# Altium project IRIS-EXT-04-BRK.PrjPcb
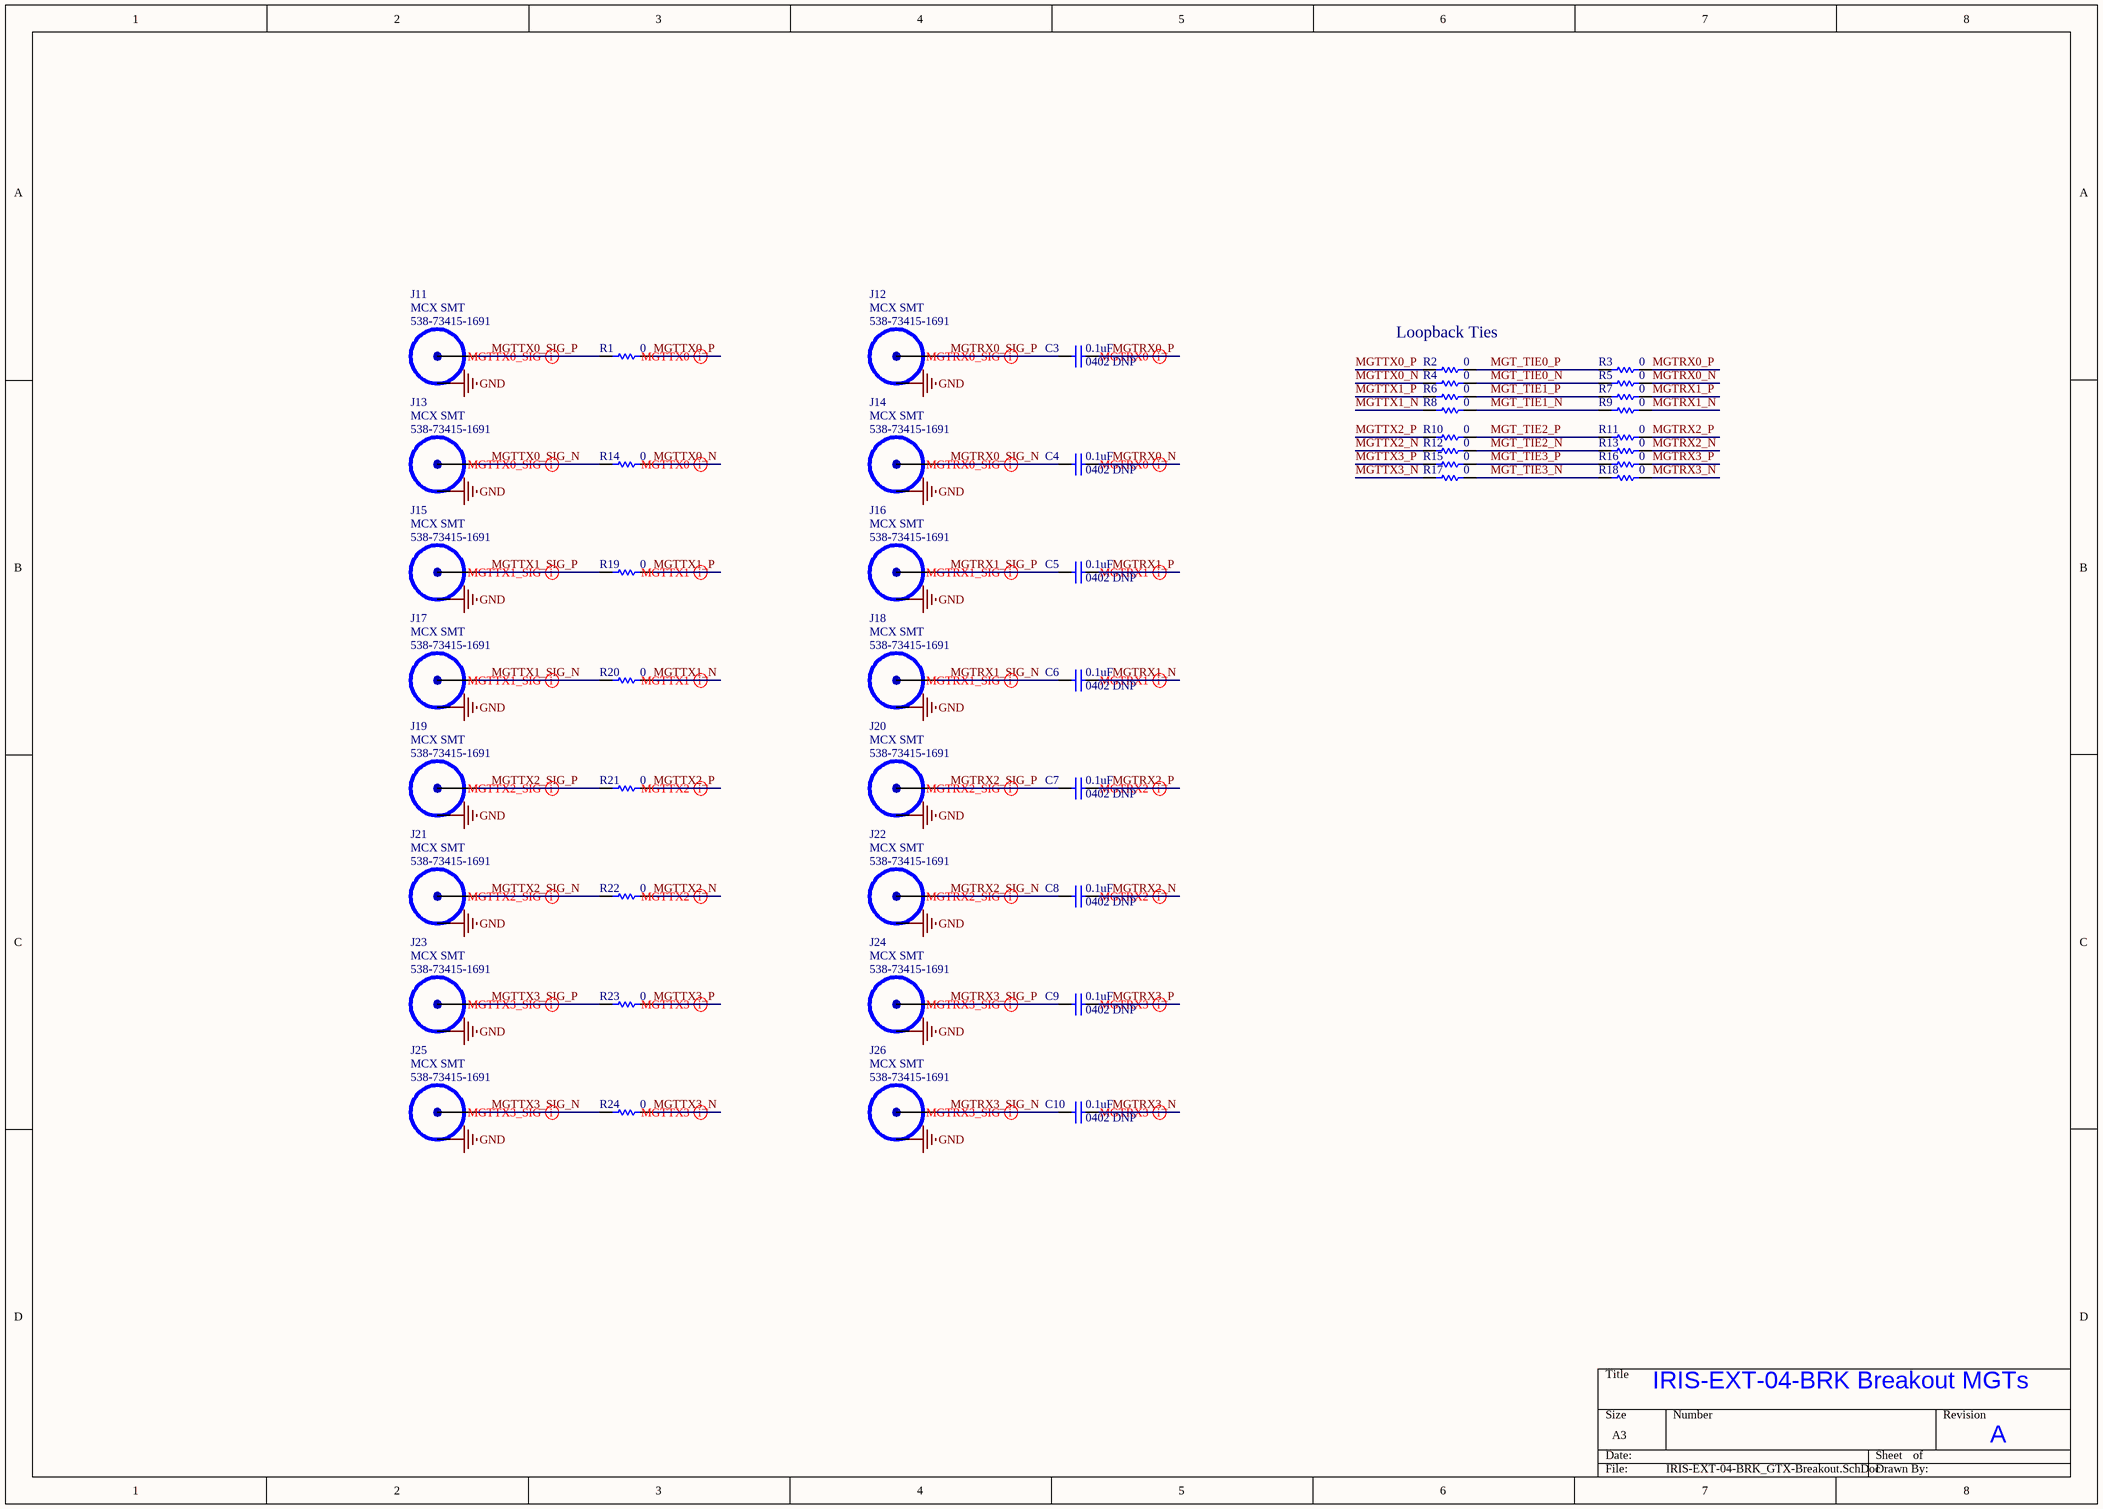
[diagram p0: IRIS-EXT-04-BRK_GTX-Breakout.SchDoc]
2 sheets, 67 parts. Net scope: global (net labels, ports and power ports of the same name join across sheets).
Board file: IRIS-EXT-04-BRK-AA.PcbDoc
Sheets:
  IRIS-EXT-04-BRK_GTX-Breakout.SchDoc
  IRIS-EXT-04-BRK_Top.SchDoc

## Sheet IRIS-EXT-04-BRK_GTX-Breakout.SchDoc
size A3

### Parts
C3  0402 DNP  value 0.1uF  [0402_SMT_CAP]
C4  0402 DNP  value 0.1uF  [0402_SMT_CAP]
C5  0402 DNP  value 0.1uF  [0402_SMT_CAP]
C6  0402 DNP  value 0.1uF  [0402_SMT_CAP]
C7  0402 DNP  value 0.1uF  [0402_SMT_CAP]
C8  0402 DNP  value 0.1uF  [0402_SMT_CAP]
C9  0402 DNP  value 0.1uF  [0402_SMT_CAP]
C10  0402 DNP  value 0.1uF  [0402_SMT_CAP]
J11  MCX SMT  Supplier Part Number 1: 538-73415-1691  [Molex-734151691]
J12  MCX SMT  Supplier Part Number 1: 538-73415-1691  [Molex-734151691]
J13  MCX SMT  Supplier Part Number 1: 538-73415-1691  [Molex-734151691]
J14  MCX SMT  Supplier Part Number 1: 538-73415-1691  [Molex-734151691]
J15  MCX SMT  Supplier Part Number 1: 538-73415-1691  [Molex-734151691]
J16  MCX SMT  Supplier Part Number 1: 538-73415-1691  [Molex-734151691]
J17  MCX SMT  Supplier Part Number 1: 538-73415-1691  [Molex-734151691]
J18  MCX SMT  Supplier Part Number 1: 538-73415-1691  [Molex-734151691]
J19  MCX SMT  Supplier Part Number 1: 538-73415-1691  [Molex-734151691]
J20  MCX SMT  Supplier Part Number 1: 538-73415-1691  [Molex-734151691]
J21  MCX SMT  Supplier Part Number 1: 538-73415-1691  [Molex-734151691]
J22  MCX SMT  Supplier Part Number 1: 538-73415-1691  [Molex-734151691]
J23  MCX SMT  Supplier Part Number 1: 538-73415-1691  [Molex-734151691]
J24  MCX SMT  Supplier Part Number 1: 538-73415-1691  [Molex-734151691]
J25  MCX SMT  Supplier Part Number 1: 538-73415-1691  [Molex-734151691]
J26  MCX SMT  Supplier Part Number 1: 538-73415-1691  [Molex-734151691]
R1  value 0  [0402_SMT_RES]  (hidden comment: 0402 DNP)
R2  value 0  [0603_SMT_RES]  (hidden comment: 0603)
R3  value 0  [0603_SMT_RES]  (hidden comment: 0603)
R4  value 0  [0603_SMT_RES]  (hidden comment: 0603)
R5  value 0  [0603_SMT_RES]  (hidden comment: 0603)
R6  value 0  [0603_SMT_RES]  (hidden comment: 0603)
R7  value 0  [0603_SMT_RES]  (hidden comment: 0603)
R8  value 0  [0603_SMT_RES]  (hidden comment: 0603)
R9  value 0  [0603_SMT_RES]  (hidden comment: 0603)
R10  value 0  [0603_SMT_RES]  (hidden comment: 0603)
R11  value 0  [0603_SMT_RES]  (hidden comment: 0603)
R12  value 0  [0603_SMT_RES]  (hidden comment: 0603)
R13  value 0  [0603_SMT_RES]  (hidden comment: 0603)
R14  value 0  [0402_SMT_RES]  (hidden comment: 0402 DNP)
R15  value 0  [0603_SMT_RES]  (hidden comment: 0603)
R16  value 0  [0603_SMT_RES]  (hidden comment: 0603)
R17  value 0  [0603_SMT_RES]  (hidden comment: 0603)
R18  value 0  [0603_SMT_RES]  (hidden comment: 0603)
R19  value 0  [0402_SMT_RES]  (hidden comment: 0402 DNP)
R20  value 0  [0402_SMT_RES]  (hidden comment: 0402 DNP)
R21  value 0  [0402_SMT_RES]  (hidden comment: 0402 DNP)
R22  value 0  [0402_SMT_RES]  (hidden comment: 0402 DNP)
R23  value 0  [0402_SMT_RES]  (hidden comment: 0402 DNP)
R24  value 0  [0402_SMT_RES]  (hidden comment: 0402 DNP)

### Nets
GND: J11.0(GND) J12.0(GND) J13.0(GND) J14.0(GND) J15.0(GND) J16.0(GND) J17.0(GND) J18.0(GND) J19.0(GND) J20.0(GND) J21.0(GND) J22.0(GND) J23.0(GND) J24.0(GND) J25.0(GND) J26.0(GND)
MGT_TIE0_N: R4.1 R5.2
MGT_TIE0_P: R2.1 R3.2
MGT_TIE1_N: R8.1 R9.2
MGT_TIE1_P: R6.1 R7.2
MGT_TIE2_N: R12.1 R13.2
MGT_TIE2_P: R10.1 R11.2
MGT_TIE3_N: R17.1 R18.2
MGT_TIE3_P: R15.1 R16.2
MGTRX0_N: C4.1 R5.1
MGTRX0_P: C3.1 R3.1
MGTRX0_SIG_N: C4.2 J14.1(SIG)
MGTRX0_SIG_P: C3.2 J12.1(SIG)
MGTRX1_N: C6.1 R9.1
MGTRX1_P: C5.1 R7.1
MGTRX1_SIG_N: C6.2 J18.1(SIG)
MGTRX1_SIG_P: C5.2 J16.1(SIG)
MGTRX2_N: C8.1 R13.1
MGTRX2_P: C7.1 R11.1
MGTRX2_SIG_N: C8.2 J22.1(SIG)
MGTRX2_SIG_P: C7.2 J20.1(SIG)
MGTRX3_N: C10.1 R18.1
MGTRX3_P: C9.1 R16.1
MGTRX3_SIG_N: C10.2 J26.1(SIG)
MGTRX3_SIG_P: C9.2 J24.1(SIG)
MGTTX0_N: R4.2 R14.2
MGTTX0_P: R1.2 R2.2
MGTTX0_SIG_N: J13.1(SIG) R14.1
MGTTX0_SIG_P: J11.1(SIG) R1.1
MGTTX1_N: R8.2 R20.2
MGTTX1_P: R6.2 R19.2
MGTTX1_SIG_N: J17.1(SIG) R20.1
MGTTX1_SIG_P: J15.1(SIG) R19.1
MGTTX2_N: R12.2 R22.2
MGTTX2_P: R10.2 R21.2
MGTTX2_SIG_N: J21.1(SIG) R22.1
MGTTX2_SIG_P: J19.1(SIG) R21.1
MGTTX3_N: R17.2 R24.2
MGTTX3_P: R15.2 R23.2
MGTTX3_SIG_N: J25.1(SIG) R24.1
MGTTX3_SIG_P: J23.1(SIG) R23.1

### Layout directives
differential pair: MGTRX0_N, MGTRX0_P, MGTRX0_SIG_N, MGTRX0_SIG_P, MGTRX1_N, MGTRX1_P, MGTRX1_SIG_N, MGTRX1_SIG_P, MGTRX2_N, MGTRX2_P, MGTRX2_SIG_N, MGTRX2_SIG_P, MGTRX3_N, MGTRX3_P, MGTRX3_SIG_N, MGTRX3_SIG_P, MGTTX0_N, MGTTX0_P, MGTTX0_SIG_N, MGTTX0_SIG_P, MGTTX1_N, MGTTX1_P, MGTTX1_SIG_N, MGTTX1_SIG_P, MGTTX2_N, MGTTX2_P, MGTTX2_SIG_N, MGTTX2_SIG_P, MGTTX3_N, MGTTX3_P, MGTTX3_SIG_N, MGTTX3_SIG_P

### Notes on the sheet
- Loopback Ties
- IRIS-EXT-04-BRK Breakout MGTs
- A

### Library data of the parts
C3-C10 = Cap_0402: 0402 SMT Capacitor; Supplier 1: Mouser; Supplier Part Number 1: 81-GRM155R71C104JA8D
J11-J26 = Molex-734151691: Molex 50 Ohm SMT MCX Jack; Supplier 1: Mouser
R1 R14 R19-R24 = Res_0402: 0402 SMT Resistor; Supplier 1: Mouser; Supplier Part Number 1: 667-ERJ-2GE0R00X
R2-R13 R15-R18 = Res_0603: 0603 SMT Resistor; Supplier 1: Mouser; Supplier Part Number 1: 667-ERJ-3GEY0R00V; Supplier 2: Digi-Key; Supplier Part Number 2: P0.0GCT-ND; ClassName: NoCollide

## Sheet IRIS-EXT-04-BRK_Top.SchDoc
size A3
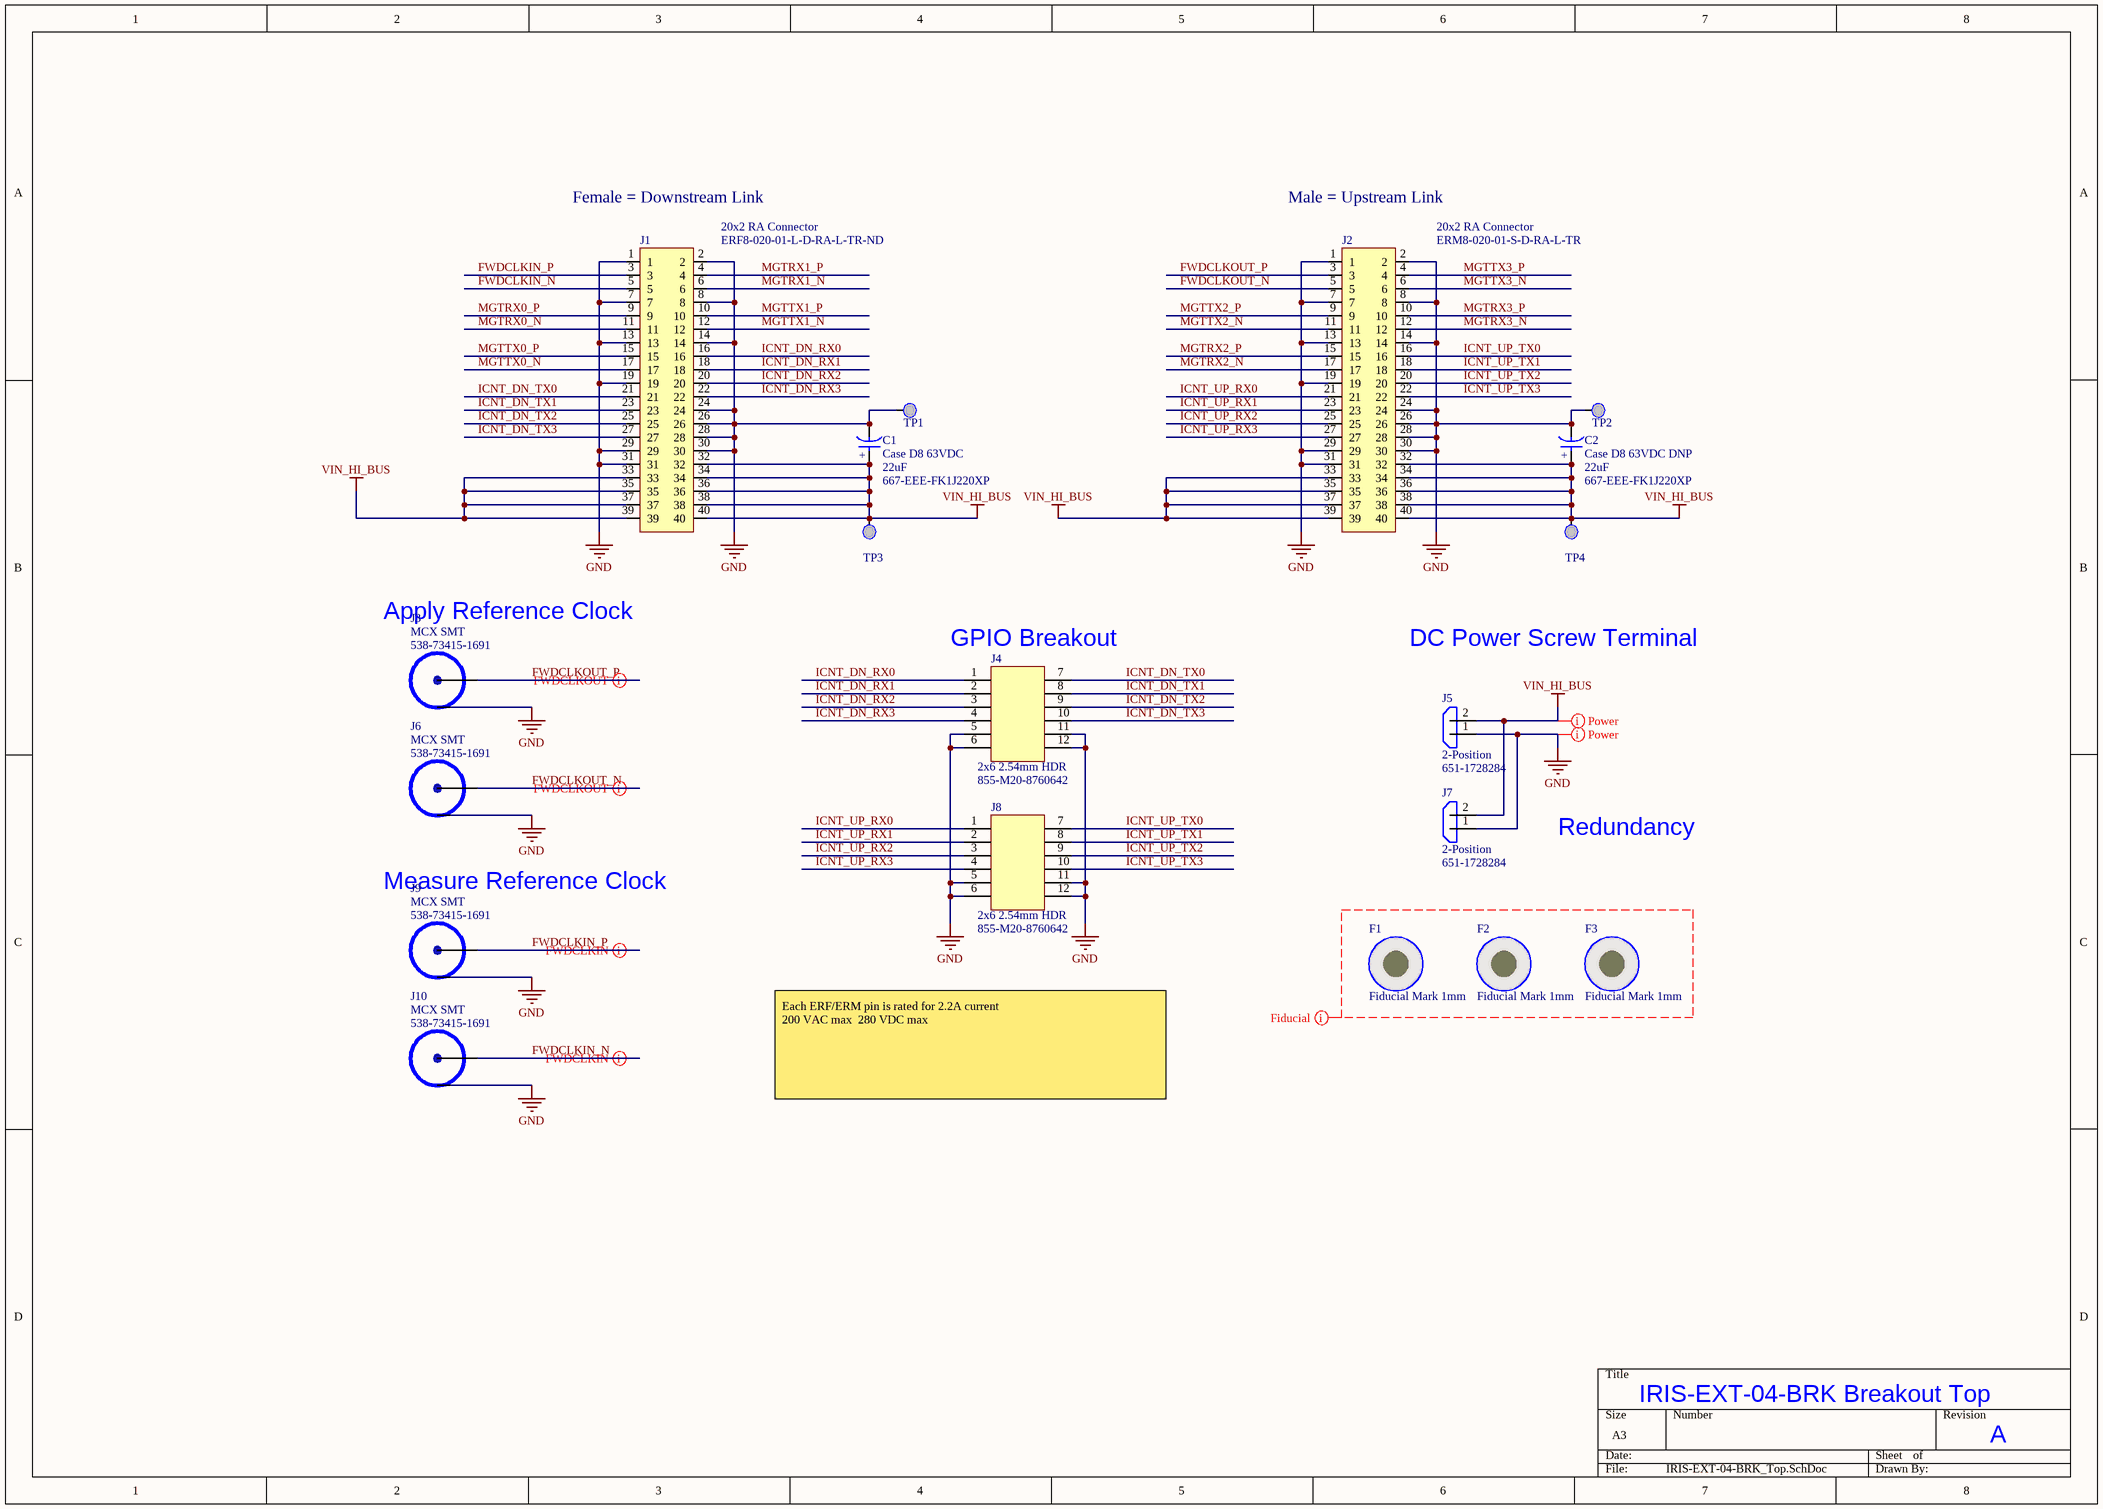
[diagram p1: IRIS-EXT-04-BRK_Top.SchDoc]

### Parts
C1  Case D8 63VDC  value 22uF  Supplier Part Number 1: 667-EEE-FK1J220XP  [Panasonic_SMT_D8]
C2  Case D8 63VDC DNP  value 22uF  Supplier Part Number 1: 667-EEE-FK1J220XP  [Panasonic_SMT_D8]
F1  Fiducial Mark 1mm  [1mm_FIDUCIAL]
F2  Fiducial Mark 1mm  [1mm_FIDUCIAL]
F3  Fiducial Mark 1mm  [1mm_FIDUCIAL]
J1  20x2 RA Connector  Supplier Part Number 1: ERF8-020-01-L-D-RA-L-TR-ND  [ERF8-020-01-L-D-RA-L-TR]
J2  20x2 RA Connector  [ERM8-020-01-S-D-RA-L-TR]
J3  MCX SMT  Supplier Part Number 1: 538-73415-1691  [Molex-734151691]
J4  2x6 2.54mm HDR  Supplier Part Number 1: 855-M20-8760642  [M20-876-350012]
J5  2-Position  Supplier Part Number 1: 651-1728284  [Phoenix-1728284]
J6  MCX SMT  Supplier Part Number 1: 538-73415-1691  [Molex-734151691]
J7  2-Position  Supplier Part Number 1: 651-1728284  [Phoenix-1728284]
J8  2x6 2.54mm HDR  Supplier Part Number 1: 855-M20-8760642  [M20-876-350012]
J9  MCX SMT  Supplier Part Number 1: 538-73415-1691  [Molex-734151691]
J10  MCX SMT  Supplier Part Number 1: 538-73415-1691  [Molex-734151691]
TP1  Testpoint  [Keystone-Red-TP]  (value not drawn)
TP2  Testpoint  [Keystone-Red-TP]  (value not drawn)
TP3  Testpoint  [Keystone-Red-TP]  (value not drawn)
TP4  Testpoint  [Keystone-Red-TP]  (value not drawn)

### Nets
GND: C1.K C2.K J1.1 J1.2 J1.7 J1.8 J1.13 J1.14 J1.19 J1.24 J1.26 J1.28 J1.29 J1.30 J1.31 J2.1 J2.2 J2.7 J2.8 J2.13 J2.14 J2.19 J2.24 J2.26 J2.28 J2.29 J2.30 J2.31 J3.0(GND) J4.5 J4.6 J4.11 J4.12 J5.1 J6.0(GND) J7.1 J8.5 J8.6 J8.11 J8.12 J9.0(GND) J10.0(GND) TP1.0 TP2.0
VIN_HI_BUS: C1.A C2.A J1.32 J1.33 J1.34 J1.35 J1.36 J1.37 J1.38 J1.39 J1.40 J2.32 J2.33 J2.34 J2.35 J2.36 J2.37 J2.38 J2.39 J2.40 J5.2 J7.2 TP3.0 TP4.0
FWDCLKIN_N: J1.5 J10.1(SIG)
FWDCLKIN_P: J1.3 J9.1(SIG)
FWDCLKOUT_N: J2.5 J6.1(SIG)
FWDCLKOUT_P: J2.3 J3.1(SIG)
ICNT_DN_RX0: J1.16 J4.1
ICNT_DN_RX1: J1.18 J4.2
ICNT_DN_RX2: J1.20 J4.3
ICNT_DN_RX3: J1.22 J4.4
ICNT_DN_TX0: J1.21 J4.7
ICNT_DN_TX1: J1.23 J4.8
ICNT_DN_TX2: J1.25 J4.9
ICNT_DN_TX3: J1.27 J4.10
ICNT_UP_RX0: J2.21 J8.1
ICNT_UP_RX1: J2.23 J8.2
ICNT_UP_RX2: J2.25 J8.3
ICNT_UP_RX3: J2.27 J8.4
ICNT_UP_TX0: J2.16 J8.7
ICNT_UP_TX1: J2.18 J8.8
ICNT_UP_TX2: J2.20 J8.9
ICNT_UP_TX3: J2.22 J8.10
MGTRX0_N: J1.11
MGTRX0_P: J1.9
MGTRX1_N: J1.6
MGTRX1_P: J1.4
MGTRX2_N: J2.17
MGTRX2_P: J2.15
MGTRX3_N: J2.12
MGTRX3_P: J2.10
MGTTX0_N: J1.17
MGTTX0_P: J1.15
MGTTX1_N: J1.12
MGTTX1_P: J1.10
MGTTX2_N: J2.11
MGTTX2_P: J2.9
MGTTX3_N: J2.6
MGTTX3_P: J2.4

### Layout directives
net class Power: GND, VIN_HI_BUS
net class Fiducial: (no net found under the mark)
differential pair: FWDCLKIN_N, FWDCLKIN_P, FWDCLKOUT_N, FWDCLKOUT_P

### Notes on the sheet
- Female = Downstream Link
- Male = Upstream Link
- Apply Reference Clock
- (near J4) GPIO Breakout
- DC Power Screw Terminal
- Redundancy
- Measure Reference Clock
- Each ERF/ERM pin is rated for 2.2A current
  200 VAC max  280 VDC max
- IRIS-EXT-04-BRK Breakout Top
- A
- (in symbol Cap_Electrolytic_SMT_D8) +

### Library data of the parts
C1 C2 = Cap_Electrolytic_SMT_D8: Electrolytic SMT Capacitor, Case D8; Supplier 1: Mouser
F1-F3 = Fiducial-1mm
J1 = ERF8-020-01-L-D-RA-L-TR: Samtec ERF8-020 Female Right-Angle with Latch; Supplier 1: Digi-Key; Supplier 2: Samtec; Supplier Part Number 2: ERF8-020-01-L-D-RA-L-TR-ND; Manufacturer 1: Samtec; Manufacturer Part Number 1: ERF8-020-01-L-D-RA-L-TR-ND
J2 = ERM8-020-01-S-D-RA-L-TR: Samtec ERM8-020 Male Right-Angle with Latch; Supplier 1: Samtec; Supplier Part Number 1: ERM8-020-01-S-D-RA-L-TR; Manufacturer 1: Samtec; Manufacturer Part Number 1: ERM8-020-01-S-D-RA-L-TR
J3 J6 J9 J10 = Molex-734151691: Molex 50 Ohm SMT MCX Jack; Supplier 1: Mouser
J4 J8 = M20-8760642: Harwin 2.54mm Thru Straight Recepticle; Supplier 1: Mouser
J5 J7 = Phoenix-1728284: Phoenix Angled Thru Screw Terminal Block 2-Pos; Supplier 1: Mouser
TP1-TP4 = Keystone-5000-5004-Red-TP: Red Through Mount Probe Testpoint; Supplier 1: Mouser; Supplier Part Number 1: 534-5000

## Nets that join several sheets
GND: IRIS-EXT-04-BRK_GTX-Breakout (16 pins), IRIS-EXT-04-BRK_Top (44 pins)
MGTRX0_N: IRIS-EXT-04-BRK_GTX-Breakout (C4.1 R5.1), IRIS-EXT-04-BRK_Top (J1.11)
MGTRX0_P: IRIS-EXT-04-BRK_GTX-Breakout (C3.1 R3.1), IRIS-EXT-04-BRK_Top (J1.9)
MGTRX1_N: IRIS-EXT-04-BRK_GTX-Breakout (C6.1 R9.1), IRIS-EXT-04-BRK_Top (J1.6)
MGTRX1_P: IRIS-EXT-04-BRK_GTX-Breakout (C5.1 R7.1), IRIS-EXT-04-BRK_Top (J1.4)
MGTRX2_N: IRIS-EXT-04-BRK_GTX-Breakout (C8.1 R13.1), IRIS-EXT-04-BRK_Top (J2.17)
MGTRX2_P: IRIS-EXT-04-BRK_GTX-Breakout (C7.1 R11.1), IRIS-EXT-04-BRK_Top (J2.15)
MGTRX3_N: IRIS-EXT-04-BRK_GTX-Breakout (C10.1 R18.1), IRIS-EXT-04-BRK_Top (J2.12)
MGTRX3_P: IRIS-EXT-04-BRK_GTX-Breakout (C9.1 R16.1), IRIS-EXT-04-BRK_Top (J2.10)
MGTTX0_N: IRIS-EXT-04-BRK_GTX-Breakout (R4.2 R14.2), IRIS-EXT-04-BRK_Top (J1.17)
MGTTX0_P: IRIS-EXT-04-BRK_GTX-Breakout (R1.2 R2.2), IRIS-EXT-04-BRK_Top (J1.15)
MGTTX1_N: IRIS-EXT-04-BRK_GTX-Breakout (R8.2 R20.2), IRIS-EXT-04-BRK_Top (J1.12)
MGTTX1_P: IRIS-EXT-04-BRK_GTX-Breakout (R6.2 R19.2), IRIS-EXT-04-BRK_Top (J1.10)
MGTTX2_N: IRIS-EXT-04-BRK_GTX-Breakout (R12.2 R22.2), IRIS-EXT-04-BRK_Top (J2.11)
MGTTX2_P: IRIS-EXT-04-BRK_GTX-Breakout (R10.2 R21.2), IRIS-EXT-04-BRK_Top (J2.9)
MGTTX3_N: IRIS-EXT-04-BRK_GTX-Breakout (R17.2 R24.2), IRIS-EXT-04-BRK_Top (J2.6)
MGTTX3_P: IRIS-EXT-04-BRK_GTX-Breakout (R15.2 R23.2), IRIS-EXT-04-BRK_Top (J2.4)

## Assembly variants
Loopback: not fitted C2 C3 C4 C5 C6 C7 C8 C9 C10 J11 J12 J13 J14 J15 J16 J17 J18 J19 J20 J21 J22 J23 J24 J25 J26 R1 R14 R19 R20 R21 R22 R23 R24
Breakout: not fitted C2 R2 R3 R4 R5 R6 R7 R8 R9 R10 R11 R12 R13 R15 R16 R17 R18